# Altium schematic sheet Video.SchDoc
size A4
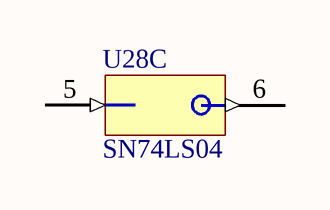
[diagram p0: Video.SchDoc]

## Parts
U28  SN74LS04  [CDIP14]  (part C of 7)

## Nets

Not connected (* = marked no-connect by the designer): U28 5(A) 6(Y)

## Library data of the parts
U28 = SN74HC04: Hex Inverters